# Altium schematic sheet CPU_A.SchDoc
size A3; Organization: Altium Limited; Address1: L3, 12a Rodborough Rd; Address2: Frenchs Forest; Address3: NSW; Address4: Australia 2086
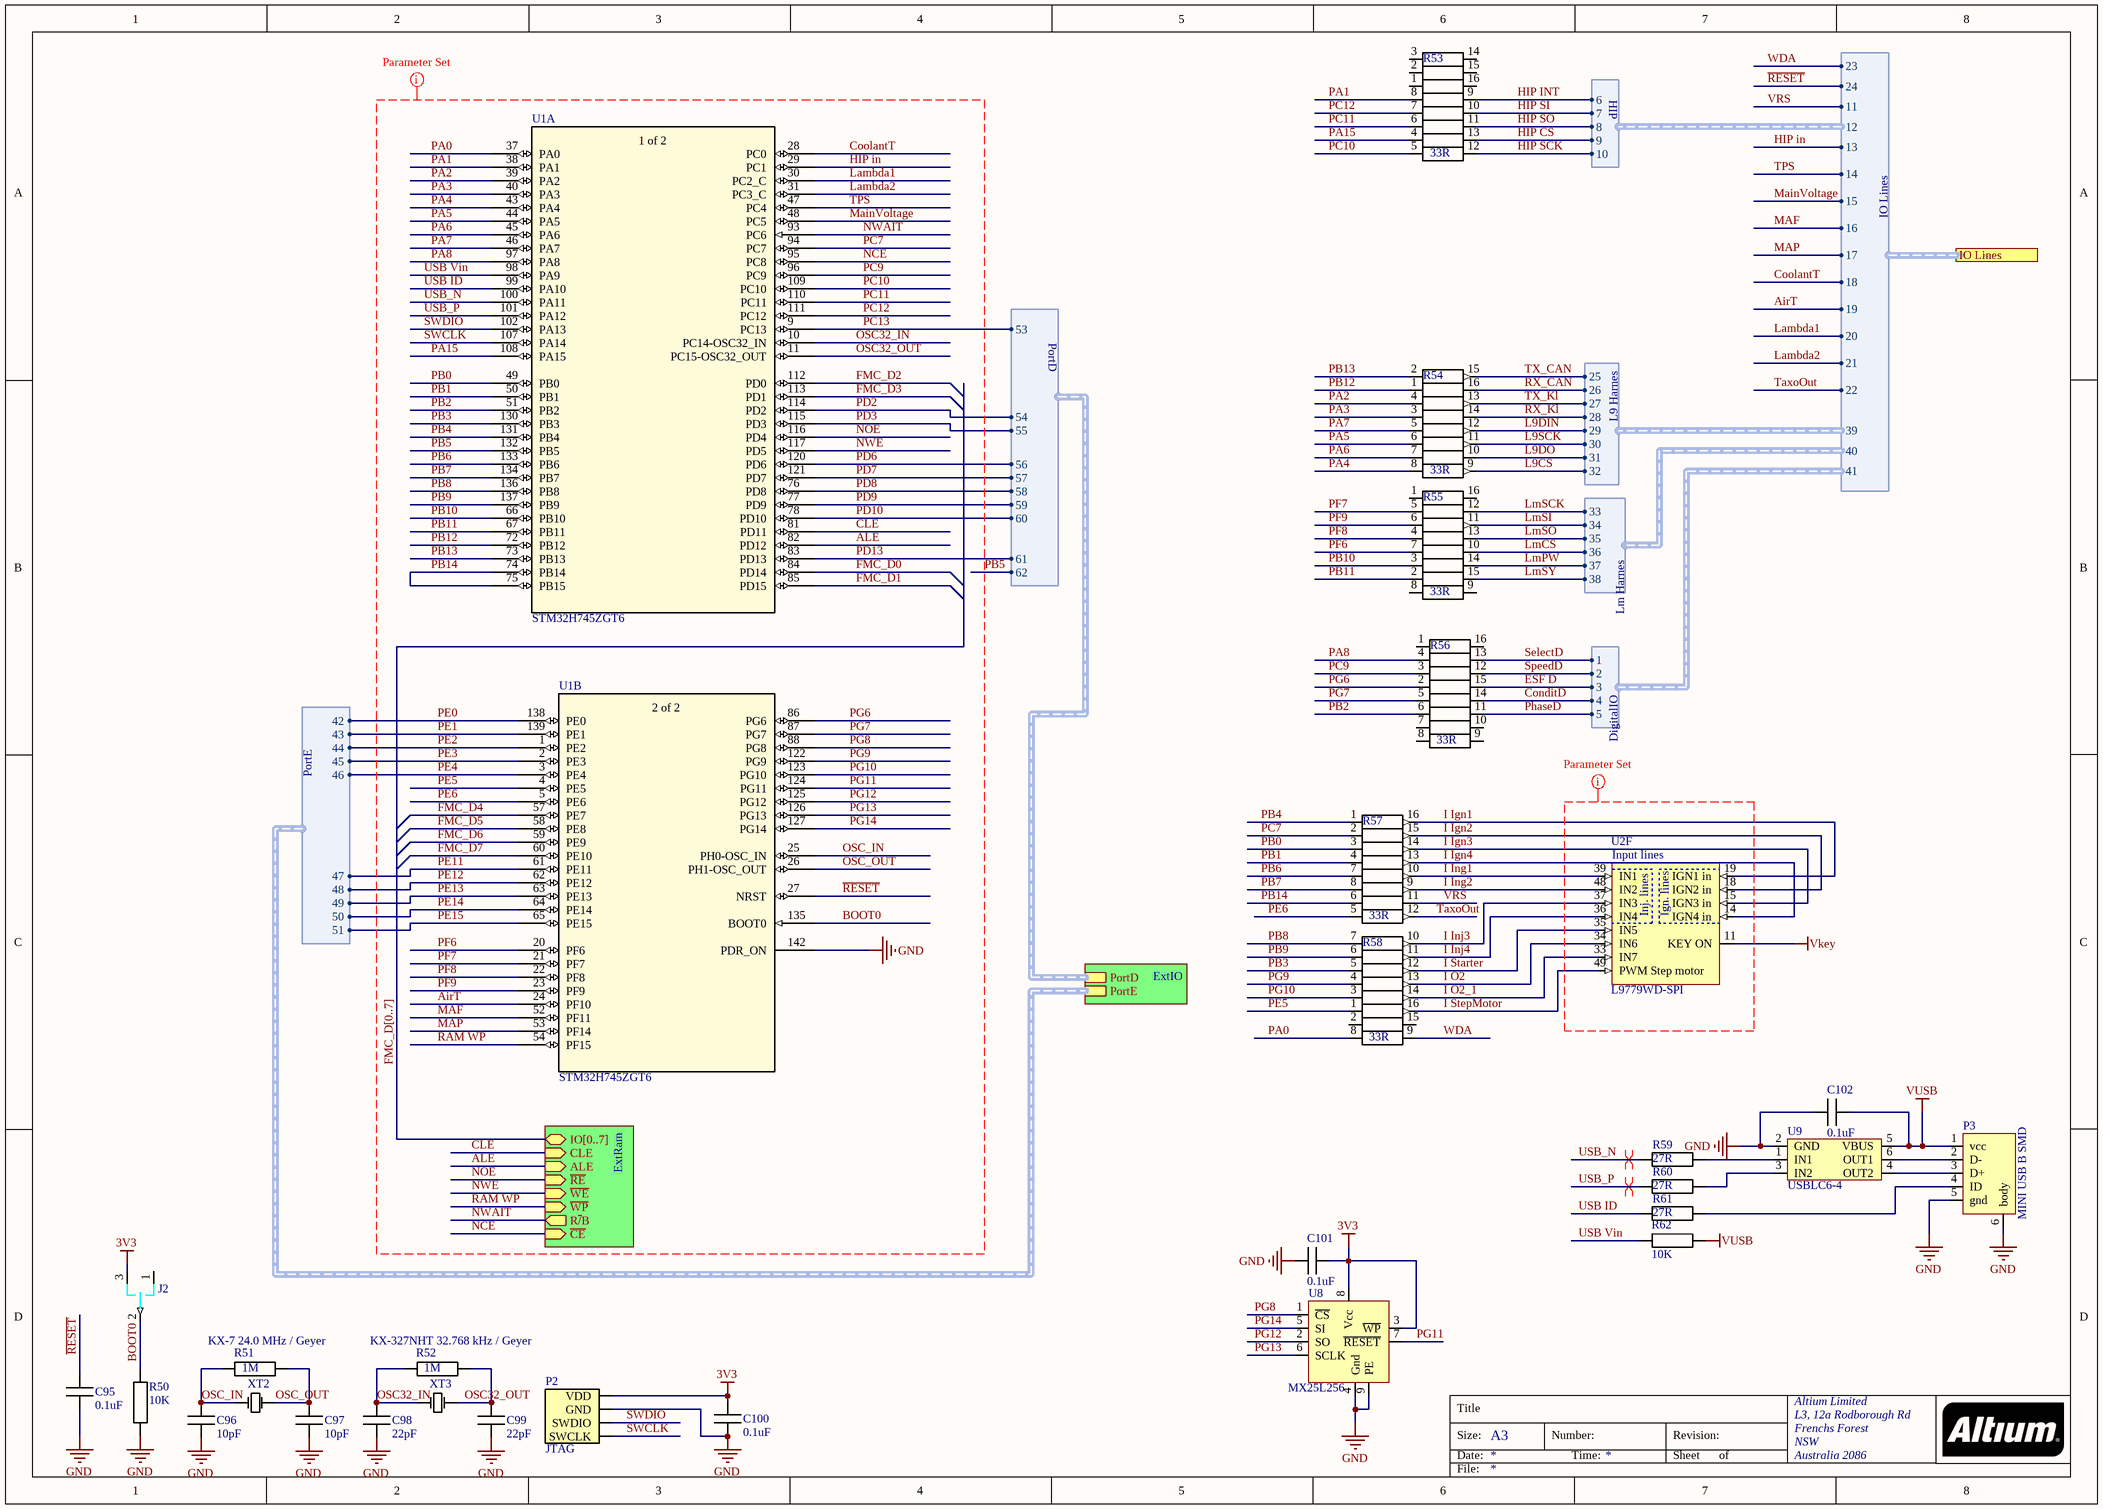
[diagram p0: CPU_A.SchDoc]

## Parts
C95  0.1uF  [SMD 0603]
C96  10pF  [SMD 0603]
C97  10pF  [SMD 0603]
C98  22pF  [SMD 0603]
C99  22pF  [SMD 0603]
C100  0.1uF  [SMD 0603]
C101  0.1uF  [SMD 0603]
C102  0.1uF  [SMD 0603]
J2  JUMPER SWITCH  [JMP3]  (value not drawn)
P2  JTAG  [HEADER 1x4]
P3  MINI USB B SMD  [MINI USB B SMD]
R50  10K  [SMD 0603]
R51  1M  [SMD 0603]
R52  1M  [SMD 0603]
R53  33R  [YC248]
R54  33R  [YC248]
R55  33R  [YC248]
R56  33R  [YC248]
R57  33R  [YC248]
R58  33R  [YC248]
R59  27R  [SMD 0603]
R60  27R  [SMD 0603]
R61  27R  [SMD 0603]
R62  10K  [SMD 0603]
U1  STM32H745ZGT6  [LQFP-144]  (parts A,B of 3)
U2  L9779WD-SPI  [HiQUAD-64]  (part F of 6)
U8  MX25L256  [WSON 8L]
U9  USBLC6-4  [SOT23-6]
XT2  KX-7 24.0 MHz / Geyer  [KX-7]
XT3  KX-327NHT 32.768 kHz / Geyer  [KX–327NHT]

## Sub-sheets
ExtIO = ExternalIO.SchDoc: PortD (harness PortD), PortE (harness PortE)
ExtRam = ExternalRAM.SchDoc: ~{RE} (in), ALE (in), ~{WE} (in), ~{WP} (in), CLE (in), R~{/}B (out), IO[0..7] (bidir), ~{CE} (in)

## Ports
IO Lines (harness IO Lines)

## Harnesses
IO Lines: 11, 12, 13, 14, 15, 16, 17, 18, 19, 20, 21, 22, 23, 24, 39, 40, 41
HIP: 6, 7, 8, 9, 10
L9 Harnes: 25, 26, 27, 28, 29, 30, 31, 32
Lm Harnes: 33, 34, 35, 36, 37, 38
DigitalIO: 1, 2, 3, 4, 5
PortE: 42, 43, 44, 45, 46, 47, 48, 49, 50, 51
PortD: 53, 54, 55, 56, 57, 58, 59, 60, 61, 62

## Nets
3V3: C100.2 C101.1 J2.3 P2.1(VDD) U8.3(~{WP}) U8.8(Vcc)
GND: C95.2 C96.2 C97.2 C98.2 C99.2 C100.1 C101.2 C102.2 P2.2(GND) P3.5(gnd) P3.6(body) R50.2 U1.142(PDR_ON) U8.4(Gnd) U8.9(PE) U9.2(GND) XT2.3 XT3.3
Vkey: U2.11(KEY_ON)
VUSB: C102.1 P3.1(vcc) R62.1 U9.5(VBUS)
~{HIP CS}: R53.13 ; harness HIP.9
~{L9CS}: R54.9 ; harness L9 Harnes.32
~{LmCS}: R55.10 ; harness Lm Harnes.36
~{RESET}: C95.1 U1.27(NRST) ; port IO Lines.24
AirT: U1.24(PF10) ; port IO Lines.19
ALE: U1.82(PD12) ; sheet ExtRam/ALE
BOOT0: J2.2 R50.1 U1.135(BOOT0)
CLE: U1.81(PD11) ; sheet ExtRam/CLE
ConditD: R56.14 ; harness DigitalIO.4
CoolantT: U1.28(PC0) ; port IO Lines.18
ESF D: R56.15 ; harness DigitalIO.3
FMC_D0: U1.84(PD14)
FMC_D1: U1.85(PD15)
FMC_D2: U1.112(PD0)
FMC_D3: U1.113(PD1)
FMC_D4: U1.57(PE7)
FMC_D5: U1.58(PE8)
FMC_D6: U1.59(PE9)
FMC_D7: U1.60(PE10)
HIP in: U1.29(PC1) ; port IO Lines.13
HIP INT: R53.9 ; harness HIP.6
HIP SCK: R53.12 ; harness HIP.10
HIP SI: R53.10 ; harness HIP.7
HIP SO: R53.11 ; harness HIP.8
I Ign1: R57.16 U2.19(IGN1_in)
I Ign2: R57.15 U2.18(IGN2_in)
I Ign3: R57.14 U2.15(IGN3_in)
I Ign4: R57.13 U2.14(IGN4_in)
I Ing1: R57.10 U2.39(IN1)
I Ing2: R57.9 U2.48(IN2)
I Inj3: R58.10 U2.37(IN3)
I Inj4: R58.11 U2.36(IN4)
I O2: R58.13 U2.34(IN6)
I O2_1: R58.14 U2.33(IN7)
I Starter: R58.12 U2.35(IN5)
I StepMotor: R58.16 U2.49(PWM_Step_motor)
L9DIN: R54.12 ; harness L9 Harnes.29
L9DO: R54.10 ; harness L9 Harnes.31
L9SCK: R54.11 ; harness L9 Harnes.30
Lambda1: U1.30(PC2_C) ; port IO Lines.20
Lambda2: U1.31(PC3_C) ; port IO Lines.21
LmPW: R55.14 ; harness Lm Harnes.37
LmSCK: R55.12 ; harness Lm Harnes.33
LmSI: R55.11 ; harness Lm Harnes.34
LmSO: R55.13 ; harness Lm Harnes.35
LmSY: R55.15 ; harness Lm Harnes.38
MAF: U1.52(PF11) ; port IO Lines.16
MainVoltage: U1.48(PC5) ; port IO Lines.15
MAP: U1.53(PF14) ; port IO Lines.17
NCE: U1.95(PC8) ; sheet ExtRam/~{CE}
NOE: U1.116(PD4) ; sheet ExtRam/~{RE}
NWAIT: U1.93(PC6) ; sheet ExtRam/R~{/}B
NWE: U1.117(PD5) ; sheet ExtRam/~{WE}
OSC32_IN: C98.1 R52.1 U1.10(PC14-OSC32_IN) XT3.1
OSC32_OUT: C99.1 R52.2 U1.11(PC15-OSC32_OUT) XT3.2
OSC_IN: C96.1 R51.1 U1.25(PH0-OSC_IN) XT2.1
OSC_OUT: C97.1 R51.2 U1.26(PH1-OSC_OUT) XT2.2
PA0: R58.8 U1.37(PA0)
PA1: R53.8 U1.38(PA1)
PA2: R54.4 U1.39(PA2)
PA3: R54.3 U1.40(PA3)
PA4: R54.8 U1.43(PA4)
PA5: R54.6 U1.44(PA5)
PA6: R54.7 U1.45(PA6)
PA7: R54.5 U1.46(PA7)
PA8: R56.4 U1.97(PA8)
PA15: R53.4 U1.108(PA15)
PB0: R57.3 U1.49(PB0)
PB1: R57.4 U1.50(PB1)
PB2: R56.6 U1.51(PB2)
PB3: R58.5 U1.130(PB3)
PB4: R57.1 U1.131(PB4)
PB5: U1.132(PB5) ; sheet ExtIO/PortD.62
PB6: R57.7 U1.133(PB6)
PB7: R57.8 U1.134(PB7)
PB8: R58.7 U1.136(PB8)
PB9: R58.6 U1.137(PB9)
PB10: R55.3 U1.66(PB10)
PB11: R55.2 U1.67(PB11)
PB12: R54.1 U1.72(PB12)
PB13: R54.2 U1.73(PB13)
PB14: R57.6 U1.74(PB14) U1.75(PB15)
PC7: R57.2 U1.94(PC7)
PC9: R56.3 U1.96(PC9)
PC10: R53.5 U1.109(PC10)
PC11: R53.6 U1.110(PC11)
PC12: R53.7 U1.111(PC12)
PC13: U1.9(PC13) ; sheet ExtIO/PortD.53
PD2: U1.114(PD2) ; sheet ExtIO/PortD.54
PD3: U1.115(PD3) ; sheet ExtIO/PortD.55
PD6: U1.120(PD6) ; sheet ExtIO/PortD.56
PD7: U1.121(PD7) ; sheet ExtIO/PortD.57
PD8: U1.76(PD8) ; sheet ExtIO/PortD.58
PD9: U1.77(PD9) ; sheet ExtIO/PortD.59
PD10: U1.78(PD10) ; sheet ExtIO/PortD.60
PD13: U1.83(PD13) ; sheet ExtIO/PortD.61
PE0: U1.138(PE0) ; sheet ExtIO/PortE.42
PE1: U1.139(PE1) ; sheet ExtIO/PortE.43
PE2: U1.1(PE2) ; sheet ExtIO/PortE.44
PE3: U1.2(PE3) ; sheet ExtIO/PortE.45
PE4: U1.3(PE4) ; sheet ExtIO/PortE.46
PE5: R58.1 U1.4(PE5)
PE6: R57.5 U1.5(PE6)
PE11: U1.61(PE11) ; sheet ExtIO/PortE.47
PE12: U1.62(PE12) ; sheet ExtIO/PortE.48
PE13: U1.63(PE13) ; sheet ExtIO/PortE.49
PE14: U1.64(PE14) ; sheet ExtIO/PortE.50
PE15: U1.65(PE15) ; sheet ExtIO/PortE.51
PF6: R55.7 U1.20(PF6)
PF7: R55.5 U1.21(PF7)
PF8: R55.4 U1.22(PF8)
PF9: R55.6 U1.23(PF9)
PG6: R56.2 U1.86(PG6)
PG7: R56.5 U1.87(PG7)
PG8: U1.88(PG8) U8.1(~{CS})
PG9: R58.4 U1.122(PG9)
PG10: R58.3 U1.123(PG10)
PG11: U1.124(PG11) U8.7(~{RESET})
PG12: U1.125(PG12) U8.2(SO)
PG13: U1.126(PG13) U8.6(SCLK)
PG14: U1.127(PG14) U8.5(SI)
PhaseD: R56.11 ; harness DigitalIO.5
RAM WP: U1.54(PF15) ; sheet ExtRam/~{WP}
RX_CAN: R54.16 ; harness L9 Harnes.26
RX_Kl: R54.14 ; harness L9 Harnes.28
SelectD: R56.13 ; harness DigitalIO.1
SpeedD: R56.12 ; harness DigitalIO.2
SWCLK: P2.4(SWCLK) U1.107(PA14)
SWDIO: P2.3(SWDIO) U1.102(PA13)
TaxoOut: R57.12 ; port IO Lines.22
TPS: U1.47(PC4) ; port IO Lines.14
TX_CAN: R54.15 ; harness L9 Harnes.25
TX_Kl: R54.13 ; harness L9 Harnes.27
USB ID: R61.1 U1.99(PA10)
USB Vin: R62.2 U1.98(PA9)
USB_N: R59.1 U1.100(PA11)
USB_P: R60.1 U1.101(PA12)
VRS: R57.11 ; port IO Lines.11
WDA: R58.9 ; port IO Lines.23
NetP3_2: P3.2(D-) U9.6(OUT1)
NetP3_3: P3.3(D+) U9.4(OUT2)
NetP3_4: P3.4(ID) R61.2
NetR59_2: R59.2 U9.1(IN1)
NetR60_2: R60.2 U9.3(IN2)

Not connected (* = marked no-connect by the designer): J2 1; R53 1 2 3 14 15 16; R55 1 8 9 16; R56 1 7 8 9 10 16; R58 2 15

## Buses and harness runs
bus FMC_D[0..7] = sheet ExtRam/IO[0..7]

## Layout directives
differential pair: USB_N, USB_P
net class L970 line: (no net found under the mark)
net class CPU Lines: AirT, ALE, BOOT0, CLE, CoolantT, FMC_D0, FMC_D1, FMC_D2, FMC_D3, FMC_D4, FMC_D5, FMC_D6, FMC_D7, FMC_D[0..7], GND, HIP in, Lambda1, Lambda2, MAF, MainVoltage, MAP, NCE, NOE, NWAIT, NWE, OSC32_IN, OSC32_OUT, OSC_IN, OSC_OUT, PA0, PA1, PA2, PA3, PA4, PA5, PA6, PA7, PA8, PA15, PB0, PB1, PB2, PB3, PB4, PB5, PB6, PB7, PB8, PB9, PB10, PB11, PB12, PB13, PB14, PC7, PC9, PC10, PC11, PC12, PC13, PD2, PD3, PD6, PD7, PD8, PD9, PD10, PD13, PE0, PE1, PE2, PE3, PE4, PE5, PE6, PE11, PE12, PE13, PE14, PE15, PF6, PF7, PF8, PF9, PG6, PG7, PG8, PG9, PG10, PG11, PG12, PG13, PG14, RAM WP, SWCLK, SWDIO, TPS, USB ID, USB Vin, USB_N, USB_P, ~{RESET}

## Notes on the sheet
- Title
- Size:
- Date:
- A3
- Number:
- Time:
- Revision:
- Sheet
- of
- File:
- (in symbol L9779WD-SPI, part F) Input lines; Inj. lines; Ign. lines
- (in symbol STM32H745ZGT6, part A) 1 of 2
- (in symbol STM32H745ZGT6, part B) 2 of 2

## Library data of the parts
C95-C102 = Capasitor
  C95 C100-C102: Value: 0.1uF
  C96 C97: Value: 10pF
  C98 C99: Value: 22pF
P2 = JTAG-STM-SW
R50 R62 = Resistor: RC0603FR-0710KL; Value: 10K
R51 R52 = Resistor: RC0603FR-071ML; Value: 1M
R53-R58 = YC248: YC248-JR-0733RL; value: 33R
R59-R61 = Resistor: RC0603FR-0727RL; Value: 27R
U1 = STM32H745ZGT6: No Description Available; Vendor: STMicroelectronics; Built_By: EMA_UL_Team; SourceLibrary: Updates_to_database_2020-10-19; Manufacturer_Part_Number: STM32H745ZGT6; Copyright: Copyright (C) 2018 Accelerated Designs. All rights reserved; RefDes: RefDes; Type: DEV
U2 = L9779WD-SPI: Multifunction IC for engine management system
U8 = MX25L256: MX25L25635FZ2I-10G
XT2 XT3 = xtall